# EAGLE design pcie2usbc (EAGLE 9.6.2)
AUTHOR: w. boyett; CONTACT_COMPANY: github.com/watsonboyett; LICENSE: CC-BY-SA; REV: 1A
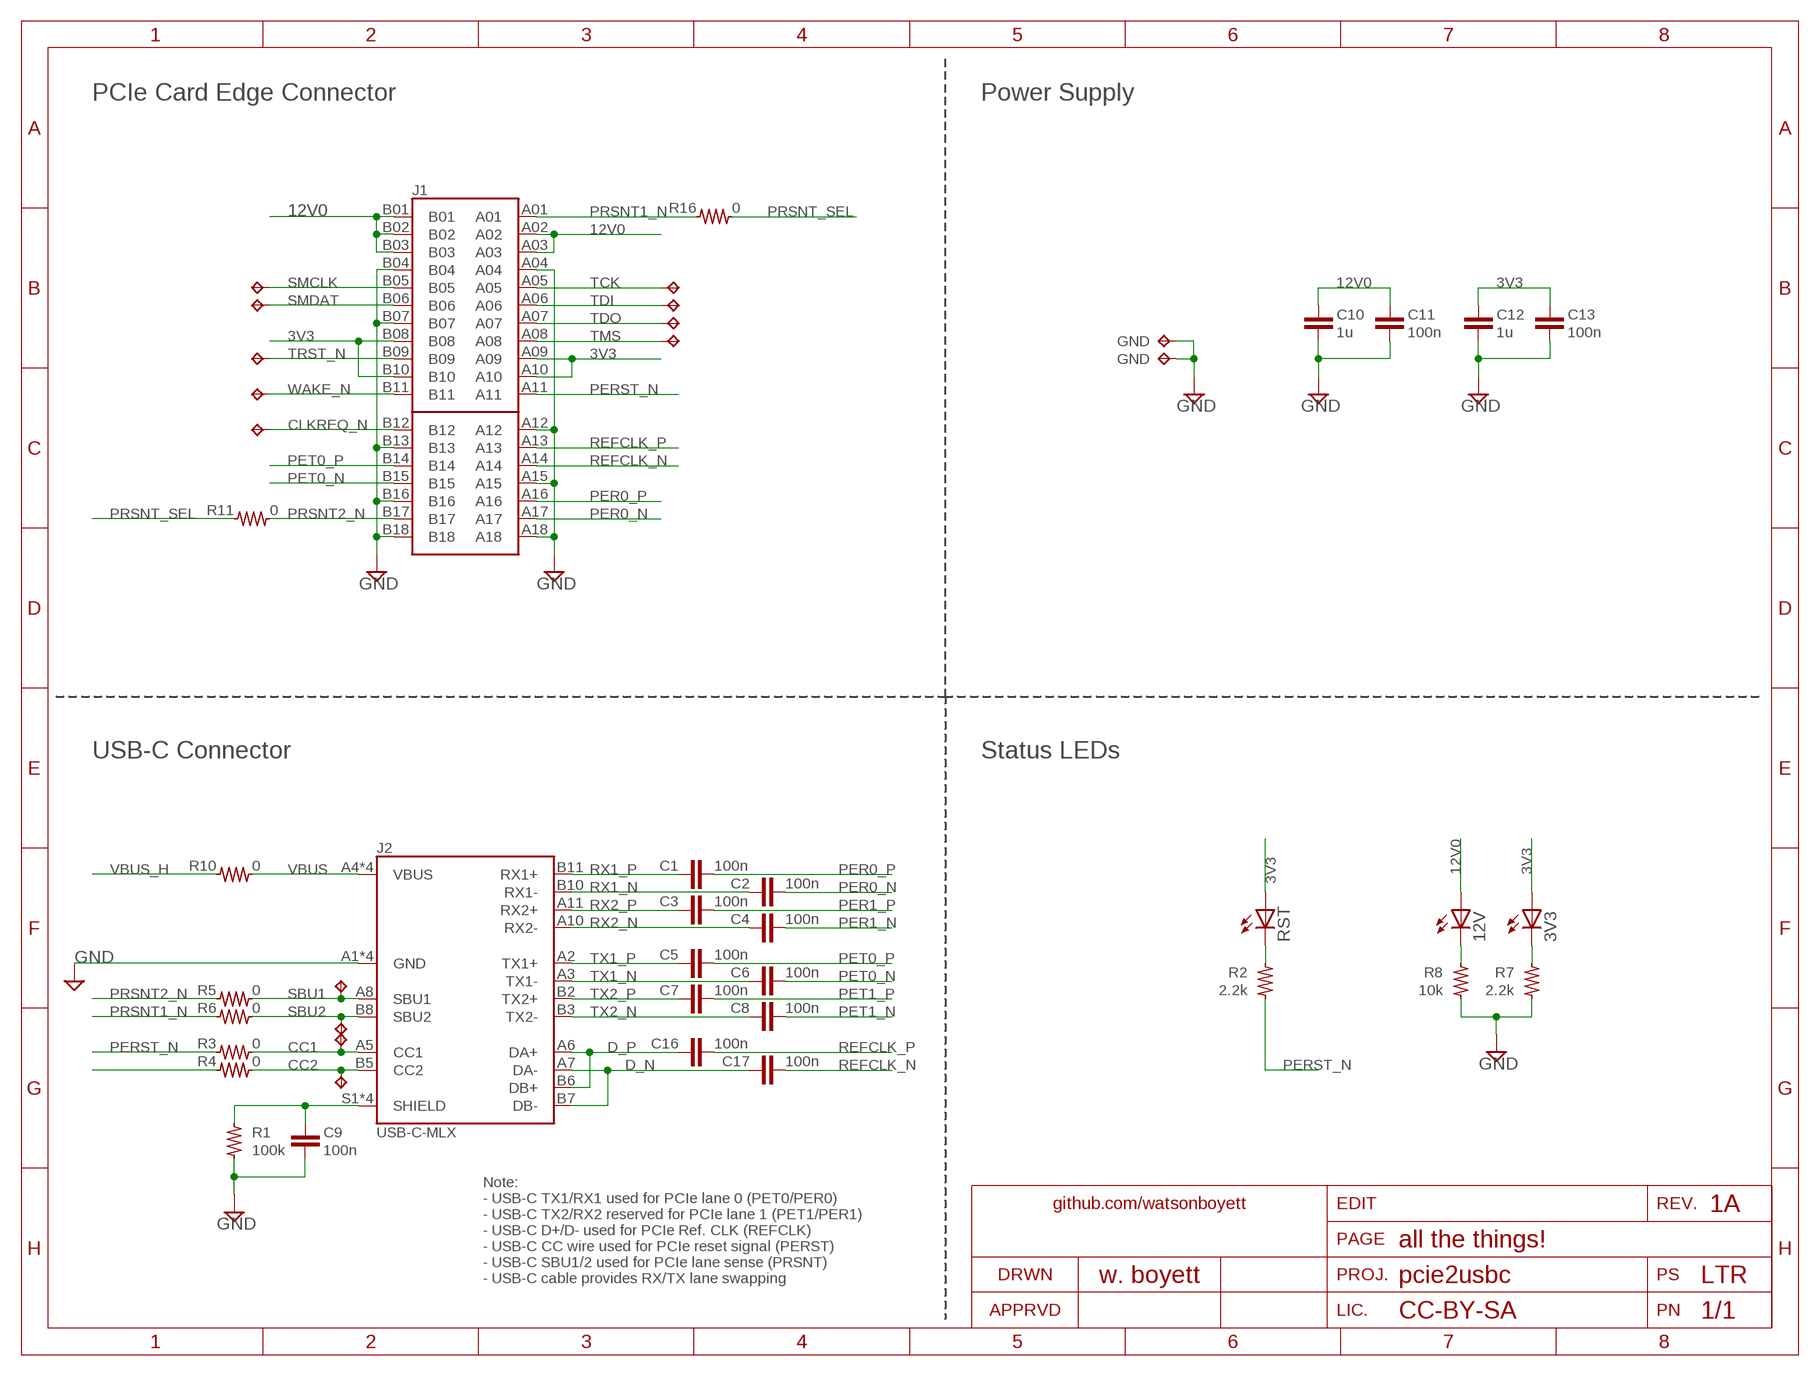
[diagram p0: schematic, sheet 1]
FRAME1 (FRAME_LTR_L): SECTION: all the things!

## Parts
3V3  LEDSML0805  [SML0805]
12V  LEDSML0805  [SML0805]
C1  100n  C-EUC0402  [C0402]
C2  100n  C-EUC0402  [C0402]
C3  100n  C-EUC0402  [C0402]
C4  100n  C-EUC0402  [C0402]
C5  100n  C-EUC0402  [C0402]
C6  100n  C-EUC0402  [C0402]
C7  100n  C-EUC0402  [C0402]
C8  100n  C-EUC0402  [C0402]
C9  100n  C-EUC0603K  [C0603K]
C10  1u  C-EUC0603K  [C0603K]
C11  100n  C-EUC0603K  [C0603K]
C12  1u  C-EUC0603K  [C0603K]
C13  100n  C-EUC0603K  [C0603K]
C16  100n  C-EUC0402  [C0402]
C17  100n  C-EUC0402  [C0402]
J1  PCIE-036-02-X-D-EMS2  [SAMTEC_PCIE-036-02-X-D-EMS2]
J2  USB-C-MLX  [MOLEX_105450-0101]
R1  100k  R-US_R0603  [R0603]
R2  2.2k  R-US_R0603  [R0603]
R3  0  R-US_R0603  [R0603]
R4  0  R-US_R0603  [R0603]
R5  0  R-US_R0603  [R0603]
R6  0  R-US_R0603  [R0603]
R7  2.2k  R-US_R0603  [R0603]
R8  10k  R-US_R0603  [R0603]
R10  0  R-US_R0603  [R0603]
R11  0  R-US_R0603  [R0603]
R16  0  R-US_R0603  [R0603]
RST  LEDSML0805  [SML0805]
TP1  TPB0,635  [B0,635]
TP2  TPB0,635  [B0,635]
TP3  TPB0,635  [B0,635]
TP4  TPB0,635  [B0,635]
TP5  TPB0,635  [B0,635]
TP6  TPB0,635  [B0,635]
TP7  TPB0,635  [B0,635]
TP8  TPB0,635  [B0,635]
TP9  TPB0,635  [B0,635]
TP10  TPTP38X20  [TP38X20]
TP11  TPB0,635  [B0,635]
TP12  TPB0,635  [B0,635]
TP13  TPTP38X20  [TP38X20]
TP16  TPB0,635  [B0,635]
TP21  TPB0,635  [B0,635]

## Nets
3V3: 3V3.A C12.1 C13.1 J1.A09 J1.A10 J1.B08 J1.B10 RST.A
12V0: 12V.A C10.1 C11.1 J1.A02 J1.A03 J1.B01 J1.B02 J1.B03
CC1: J2.A5(CC1) R3.2 TP21.TP
CC2: J2.B5(CC2) R4.1 TP16.TP
CLKREQ_N: J1.B12 TP9.TP
D_N [DIFF100]: C17.1 J2.A7(DA-) J2.B7(DB-)
D_P [DIFF100]: C16.1 J2.A6(DA+) J2.B6(DB+)
GND: C9.2 C10.2 C11.2 C12.2 C13.2 J1.A04 J1.A12 J1.A15 J1.A18 J1.B04 J1.B07 J1.B13 J1.B16 J1.B18 J2.A1(GND) J2.A12(GND) J2.B1(GND) J2.B12(GND) R1.1 R7.1 R8.1 TP10.TP TP13.TP
N$1: 12V.C R8.2
N$2: R4.2
N$3: 3V3.C R7.2
N$4: R2.2 RST.C
PER0_N [DIFF100]: C2.2 J1.A17
PER0_P [DIFF100]: C1.2 J1.A16
PER1_N: C4.2
PER1_P: C3.2
PERST_N: J1.A11 R2.1 R3.1
PET0_N [DIFF100]: C6.2 J1.B15
PET0_P [DIFF100]: C5.2 J1.B14
PET1_N: C8.2
PET1_P: C7.2
PRSNT1_N: J1.A01 R6.1 R16.1
PRSNT2_N: J1.B17 R5.1 R11.2
PRSNT_SEL: R11.1 R16.2
REFCLK_N [DIFF100]: C17.2 J1.A14
REFCLK_P [DIFF100]: C16.2 J1.A13
RX1_N [DIFF100]: C2.1 J2.B10(RX1-)
RX1_P [DIFF100]: C1.1 J2.B11(RX1+)
RX2_N [DIFF100]: C4.1 J2.A10(RX2-)
RX2_P [DIFF100]: C3.1 J2.A11(RX2+)
SBU1: J2.A8(SBU1) R5.2 TP11.TP
SBU2: J2.B8(SBU2) R6.2 TP12.TP
SMCLK: J1.B05 TP5.TP
SMDAT: J1.B06 TP6.TP
TCK: J1.A05 TP1.TP
TDI: J1.A06 TP2.TP
TDO: J1.A07 TP3.TP
TMS: J1.A08 TP4.TP
TRST_N: J1.B09 TP7.TP
TX1_N [DIFF100]: C6.1 J2.A3(TX1-)
TX1_P [DIFF100]: C5.1 J2.A2(TX1+)
TX2_N [DIFF100]: C8.1 J2.B3(TX2-)
TX2_P [DIFF100]: C7.1 J2.B2(TX2+)
USB_SHLD1: C9.1 J2.S1(SHIELD) J2.S2(SHIELD) J2.S3(SHIELD) J2.S4(SHIELD) R1.2
VBUS: J2.A4(VBUS) J2.A9(VBUS) J2.B4(VBUS) J2.B9(VBUS) R10.2
VBUS_H: R10.1
WAKE_N: J1.B11 TP8.TP

## Notes on the sheet
- PCIe Card Edge Connector | Power Supply
- USB-C Connector | Status LEDs
- Note: 
  - USB-C TX1/RX1 used for PCIe lane 0 (PET0/PER0)
  - USB-C TX2/RX2 reserved for PCIe lane 1 (PET1/PER1)
  - USB-C D+/D- used for PCIe Ref. CLK (REFCLK)
  - USB-C CC wire used for PCIe reset signal (PERST)
  - USB-C SBU1/2 used for PCIe lane sense (PRSNT)
  - USB-C cable provides RX/TX lane swapping

## Library data of the parts
3V3 12V RST = pcie2usbc:LED: LED OSRAM: - CHIPLED LG R971, LG N971, LY N971, LG Q971, LY Q971, LO R971, LY R971 LH N974, LH R974 LS Q976, LO Q976, LY Q976 LO Q996 - Hyper CHIPLED LW Q18S LB Q993, LB Q99A, LB R99A - SideLED LS A670, LO A670, LY A670, LG A670, LP A670 LB A673, LV A673, LT A673, LW A673 LH A674 LY A675 LS A676, LA A676, LO A676, LY A676, LW A676 LS A679, LY A679, LG A679 - Hyper Micro SIDELED® LS Y876, LA Y876, LO Y876, LY Y876 LT Y87S - SmartLED LW L88C, LW L88S LB L89C, LB L89S, LG L890 LS L89K, LO L89K, LY L89K LS L896, LA L896, LO L896, LY L896 - TOPLED LS T670, LO T670, LY T670, LG T670, LP T670 LSG T670, LSP T670, LSY T670, LOP T670, LYG T670 LG T671, LOG T671, LSG T671 LB T673, LV T673, LT T673, LW T673 LH T674 LS T676, LA T676, LO T676, LY T676, LB T676, LH T676, LSB T676, LW T676 LB T67C, LV T67C, LT T67C, LS T67K, LO T67K, LY T67K, LW E67C LS E67B, LA E67B, LO E67B, LY E67B, LB E67C, LV E67C, LT E67C LW T67C LS T679, LY T679, LG T679 LS T770, LO T770, LY T770, LG T770, LP T770 LB T773, LV T773, LT T773, LW T773 LH T774 LS E675, LA E675, LY E675, LS T675 LS T776, LA T776, LO T776, LY T776, LB T776 LHGB T686 LT T68C, LB T68C - Hyper Mini TOPLED® LB M676 - Mini TOPLED Santana® LG M470 LS M47K, LO M47K, LY M47K Source: http://www.osram.convergy.de LUXEON: - LUMILED® LXK2-PW12-R00, LXK2-PW12-S00, LXK2-PW14-U00, LXK2-PW14-V00 LXK2-PM12-R00, LXK2-PM12-S00, LXK2-PM14-U00 LXK2-PE12-Q00, LXK2-PE12-R00, LXK2-PE12-S00, LXK2-PE14-T00, LXK2-PE14-U00 LXK2-PB12-K00, LXK2-PB12-L00, LXK2-PB12-M00, LXK2-PB14-N00, LXK2-PB14-P00, LXK2-PB14-Q00 LXK2-PR12-L00, LXK2-PR12-M00, LXK2-PR14-Q00, LXK2-PR14-R00 LXK2-PD12-Q00, LXK2-PD12-R00, LXK2-PD12-S00 LXK2-PH12-R00, LXK2-PH12-S00 LXK2-PL12-P00, LXK2-PL12-Q00, LXK2-PL12-R00 Source: www.luxeon.com KINGBRIGHT: KA-3528ASYC Source: www.kingbright.com
C1-C8 C16 C17 = pcie2usbc:C-EU: CAPACITOR, European symbol
C9-C13 = pcie2usbc:C-EU: CAPACITOR, European symbol; DESCRIPTION: CAP CER 0.1UF 25V X7R 0603; MFG: Yageo; MPN: CC0603KRX7R8BB104; PN-DK: 311-1341-1-ND
J1 = pcie2usbc:PCIE-036-02-X-D-EMS2: PCI EXPRESS EDGE MOUNT ASSEMBLY,36PINS.; MANUFACTURER: Samtec; MAXIMUM_PACKAGE_HEIGHT: 3.715mm; PARTREV: C; STANDARD: Manufacturer Recommendations
J2 = pcie2usbc:USB-C: Usb Type-c, Ra Rcpt, Pcb Mount,; MFG: Molex; MPN: 1054500101; PN-DK: WM12856CT-ND
R1 = pcie2usbc:R-US_: RESISTOR, American symbol; DESCRIPTION: RES SMD 100K OHM 1% 1/10W 0603; MFG: Yageo; MPN: RC0603FR-07100KL; PN-DK: 311-100KHRCT-ND
R2-R8 R10 R11 R16 = pcie2usbc:R-US_: RESISTOR, American symbol
TP1-TP9 TP11 TP12 TP16 TP21 = pcie2usbc:TP: Test pad; DNP: DNP
TP10 TP13 = pcie2usbc:TP: Test pad; MFG: Keystone Electronics; MPN: 5019; PN-DK: 36-5019CT-ND; TP_SIGNAL_NAME: GND

## Net classes
0 default: width 0.152 mm
1 DIFF100: width 0.127 mm, clearance 0.305 mm
2 DIFF90: width 0.152 mm, clearance 0.305 mm

## Board
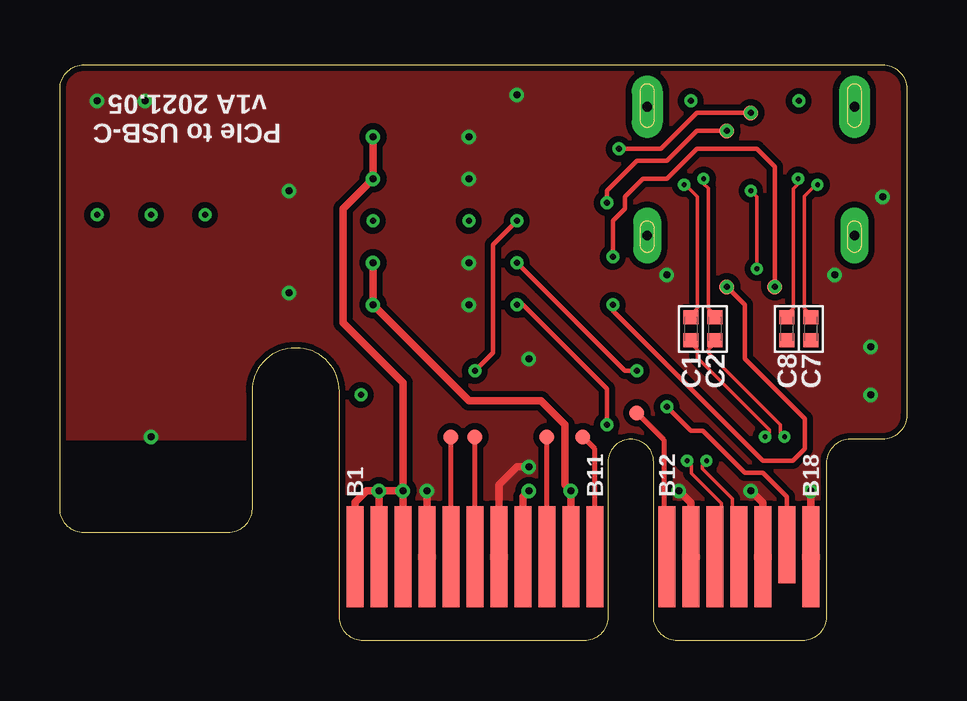
[diagram p1: board, top side]
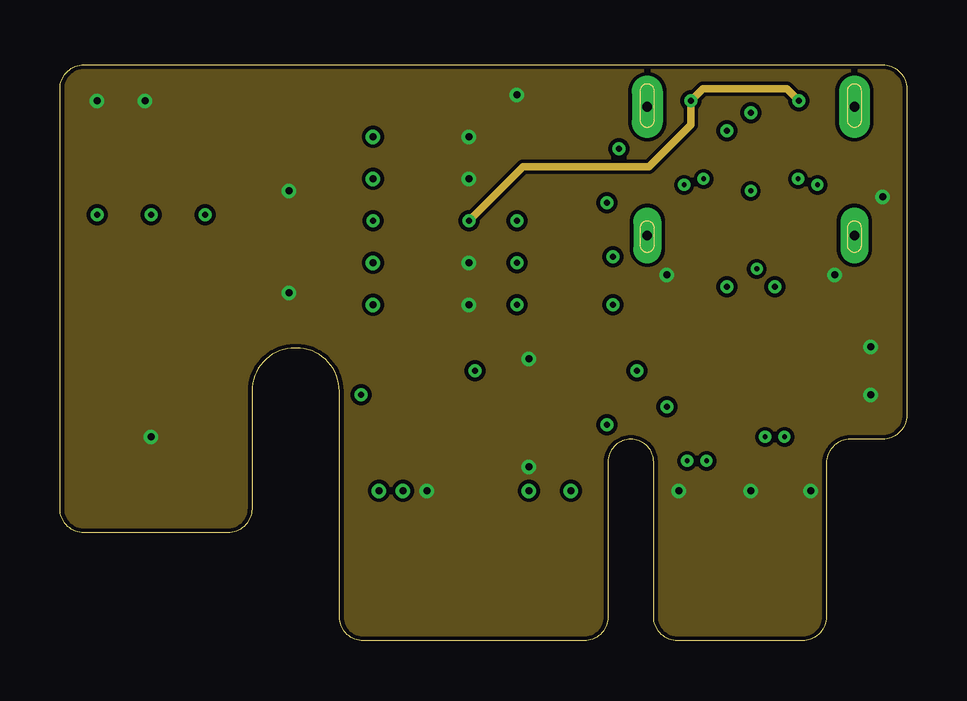
[diagram p2: board, inner layer GND1]
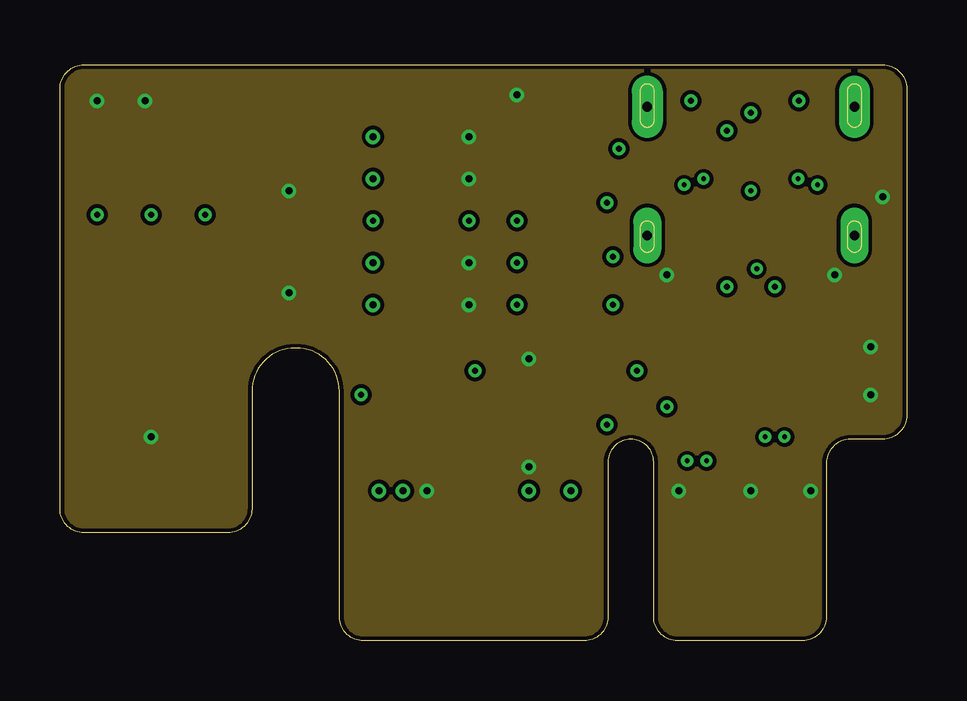
[diagram p3: board, inner layer GND2]
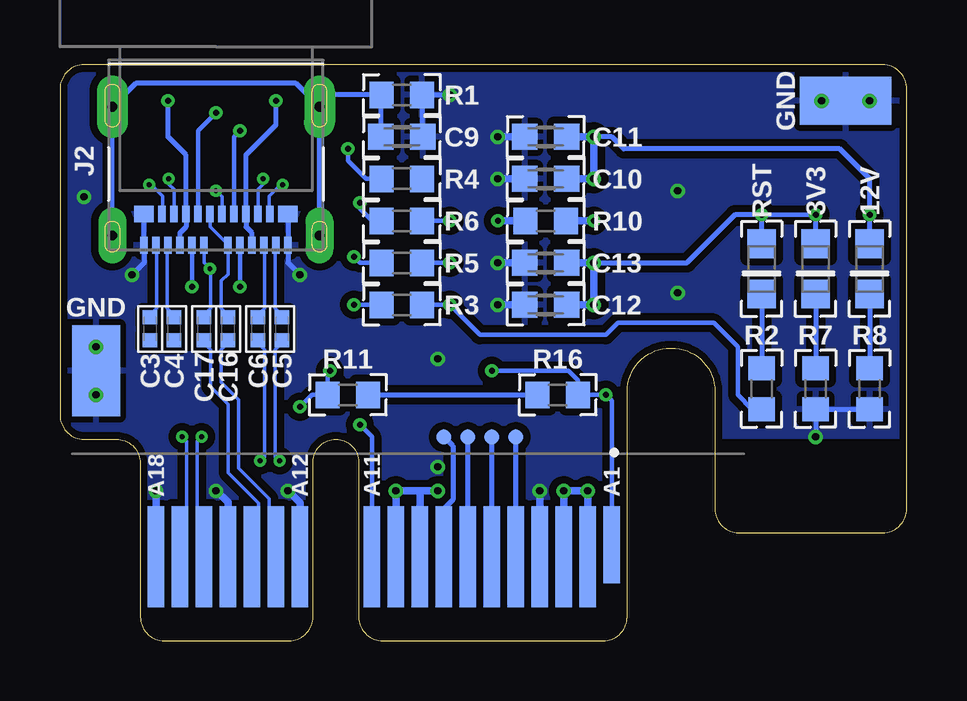
[diagram p4: board, bottom side, seen from below]

Size 35.3 x 24 mm. Coordinates in mm from the lower left corner, seen from the top.
Outline: 0,5.5 0,23 arc-90 1,24 34.3,24 arc-90 35.3,23 35.3,9.4 arc-90 34.3,8.4 32.95,8.4 arc90 31.95,7.4 31.95,1 arc-90 30.95,0 25.75,0 arc-90 24.75,1 24.75,7.45 arc90 23.8,8.4 arc90 22.85,7.45 22.85,1 arc-90 21.85,0 12.65,0 arc-90 11.65,1 11.65,10.4 arc90 9.85,12.2 9.8,12.2 arc90 8,10.4 8,5.5 arc-90 7,4.5 1,4.5 arc-90 0,5.5
Copper layers (1+2*15+16): Top 0.035mm / dielectric 0.11mm / GND1 0.035mm / dielectric 1.2mm / GND2 0.035mm / dielectric 0.11mm / Bottom 0.035mm
Design rules "default *": minimum track width 6mil, minimum drill 0.25mm, track to track 6mil, track to pad 6mil, pad to pad 6mil, via to via 6mil, smd to smd 6mil, copper to edge 7mil, drill to drill 6mil, minimum pad ring 15mil, minimum via ring 6mil, stop-mask expansion 2mil, vias tented up to drill 20mil, thermal gap 10mil
tRestrict: area -0.2,4.5 to 8.3,8
bRestrict: area -0.2,4.5 to 8.3,8

### Footprints (pad centres in the part's own frame; a part is rotated, then mirrored left to right if it is on the bottom)
SML0805 = smd 1.2 x 1.2: A 1.05,0; C -1.05,0
C0402 = smd 0.57 x 0.62: 1 -0.48,0; 2 0.48,0
C0603K = smd 1.05 x 1.08: 1 -0.875,0; 2 0.875,0
SAMTEC_PCIE-036-02-X-D-EMS2 = smd 0.7 x 3.2: A01 -11.5,-4 | smd 0.7 x 4.2: A02 -10.5,-3.5; A03 -9.5,-3.5; A04 -8.5,-3.5; A05 -7.5,-3.5; A06 -6.5,-3.5; A07 -5.5,-3.5; A08 -4.5,-3.5; A09 -3.5,-3.5; A10 -2.5,-3.5; A11 -1.5,-3.5; A12 1.5,-3.5; A13 2.5,-3.5; A14 3.5,-3.5; A15 4.5,-3.5; A16 5.5,-3.5; A17 6.5,-3.5; A18 7.5,-3.5 | smd 0.7 x 4.2 bottom: B01 -11.5,-3.5; B02 -10.5,-3.5; B03 -9.5,-3.5; B04 -8.5,-3.5; B05 -7.5,-3.5; B06 -6.5,-3.5; B07 -5.5,-3.5; B08 -4.5,-3.5; B09 -3.5,-3.5; B10 -2.5,-3.5; B11 -1.5,-3.5; B12 1.5,-3.5; B13 2.5,-3.5; B14 3.5,-3.5; B15 4.5,-3.5; B16 5.5,-3.5; B18 7.5,-3.5 | smd 0.7 x 3.2 bottom: B17 6.5,-4
MOLEX_105450-0101 = smd 0.3 x 0.7: A1 -3,3.77; A2 -2.5,3.77; A3 -2,3.77; A4 -1.5,3.77; A5 -1,3.77; A6 -0.5,3.77; A7 0.5,3.77; A8 1,3.77; A9 1.5,3.77; A10 2,3.77; A11 2.5,3.77; A12 3,3.77; B2 2.25,2.47; B3 1.75,2.47; B4 1.25,2.47; B5 0.75,2.47; B6 0.25,2.47; B7 -0.25,2.47; B8 -0.75,2.47; B9 -1.25,2.47; B10 -1.75,2.47; B11 -2.25,2.47 | smd 0.8 x 0.7: B1 3,2.47; B12 -3,2.47 | drill 0.406 pad 1.1 long: S1 -4.32,3.36; S2 4.32,3.36 | drill 0.406 pad 1.3 long: S3 -4.32,-2; S4 4.32,-2
R0603 = smd 1 x 1.1: 1 -0.85,0; 2 0.85,0
B0,635 = smd 0.635 x 0.635: TP 0,0
TP38X20 = smd 3.8 x 2: TP 0,0

### Placement (x,y rotation side)
3V3  3.8,15.5 90 bottom
12V  1.55,15.5 90 bottom
C1  26.3,13 270 top
C2  27.3,13 270 top
C3  31.55,13 270 bottom
C4  30.55,13 270 bottom
C5  26.05,13 270 bottom
C6  27.05,13 270 bottom
C7  31.3,13 270 top
C8  30.3,13 270 top
C9  21.05,21 0 bottom
C10  15.05,19.25 180 bottom
C11  15.05,21 180 bottom
C12  15.05,14 180 bottom
C13  15.05,15.75 180 bottom
C16  28.3,13 270 bottom
C17  29.3,13 270 bottom
J1  23.8,0 180 bottom
J2  28.8,20.25 180 bottom
R1  21.05,22.75 180 bottom
R2  6.05,10.5 90 bottom
R3  21.05,14 180 bottom
R4  21.05,19.25 0 bottom
R5  21.05,15.75 180 bottom
R6  21.05,17.5 180 bottom
R7  3.8,10.5 90 bottom
R8  1.55,10.5 90 bottom
R10  15.05,17.5 180 bottom
R11  23.3,10.25 180 bottom
R16  14.55,10.25 180 bottom
RST  6.05,15.5 90 bottom
TP1  16.3,8.5 270 bottom
TP2  17.3,8.5 270 bottom
TP3  18.3,8.5 270 bottom
TP4  19.3,8.5 270 bottom
TP5  16.3,8.5 90 top
TP6  17.3,8.5 90 top
TP7  20.3,8.5 90 top
TP8  21.8,8.5 90 top
TP9  24.05,9.5 90 top
TP10  2.55,22.5 180 bottom
TP11  29.8,14.75 90 top
TP12  27.8,21.25 90 top
TP13  33.8,11.25 90 bottom
TP16  28.8,22 0 top
TP21  27.8,14.75 0 top

### Tracks (layer width: path | path; a pad name or v marks a point on that pad's centre or on a via)
3V3  (via drill 0.25, 0.3)
  Top 0.305: v19.55,6.25 19.3,6 J1.B08 | J1.B10 v21.3,6.25 21.05,6.5 21.05,9 20.05,10 17.05,10 v13.05,14 v13.05,15.75
  Bottom 0.178: v6.05,17.75 v3.8,17.75
  Bottom 0.203: 3V3.A v3.8,17.75 | RST.A v6.05,17.75 7.18,17.75 9.18,15.75 v13.05,15.75
  Bottom 0.305: J1.B10 v21.3,6.25 20.3,6.25 | J1.A09 20.3,6.25 | 20.3,6.25 v19.55,6.25 | C13.1 v13.05,15.75 v13.05,14 C12.1
12V0  (via drill 0.25, 0.3)
  Top 0.305: J1.B03 v14.3,6.25 | J1.A02 v13.3,6.25 | J1.B01 12.3,5.77 12.78,6.25 v13.3,6.25 | v13.3,6.25 v14.3,6.25 | v14.3,6.25 14.3,10.75 11.8,13.25 11.8,18 v13.05,19.25 v13.05,21
  Bottom 0.203: 12V.A v1.55,17.75 1.55,19.25 2.8,20.5 11.8,20.5 12.3,21 v13.05,21
  Bottom 0.305: J1.A02 v13.3,6.25 v14.3,6.25 J1.B03 | C10.1 v13.05,19.25 v13.05,21 C11.1
CC1  (via drill 0.25)
  Top 0.178: TP21.TP 28.55,14 28.55,11.75 31.05,9.25 31.05,8 30.55,7.5 29.3,7.5 23.05,13.75 v23.05,14
  Bottom 0.178: J2.A5 TP21.TP | R3.2 v23.05,14
  other vias: 27.8,14.75
CC2  (via drill 0.25)
  Top 0.178: v23.3,20.5 25.05,20.5 26.55,22 TP16.TP
  Bottom 0.178: J2.B5 29.55,21.25 TP16.TP | v23.3,20.5 23.3,20 22.55,19.25 R4.1
  other vias: 28.8,22
CLKREQ_N
  Top 0.203: J1.B12 25.18,3.62 25.18,8.38 TP9.TP
D_N  (via drill 0.2)
  Top 0.152: v28.8,18.75 29.05,18.5 v29.05,15.5
  Bottom 0.152: v28.8,18.75 28.55,18.5 J2.B7 | J2.A7 29.3,15.75 v29.05,15.5 29.03,15.48 29.03,13.87 29.3,13.6 C17.1
D_P
  Bottom 0.152: J2.B6 29.05,17.25 28.3,16.5 J2.A6 28.3,15.27 28.57,15 28.57,13.87 28.3,13.6 C16.1
GND  (via drill 0.3)
  Top 0.305: J1.A04 v15.3,6.25 | J1.A18 v31.3,6.25 | v28.8,6.25 29.3,5.75 J1.B16 | J1.B13 26.3,5.75 v25.8,6.25 | J1.B07 18.3,6.5 19.05,7.25 v19.55,7.25
  Bottom 0.203: C9.2 20.2,21.02 R1.1 v19.05,22.75 | v33.8,10.25 TP13.TP v33.8,12.25 | v1.55,22.5 TP10.TP v3.55,22.5 | v32.3,15.25 31.8,15.75 J2.A12 J2.B1 | J2.B12 J2.A1 25.8,15.75 v25.3,15.25 | v3.8,8.5 R7.1 R8.1
  Bottom 0.254: v28.8,6.25 28.78,6.25
  Bottom 0.305: J1.A04 v15.3,6.25 | J1.A12 25.3,5.75 v25.8,6.25 | J1.A18 v31.3,6.25 | J1.A15 28.3,5.77 28.78,6.25 | v17.05,19.25 C10.2 | C11.2 v17.05,21 | C12.2 v17.05,14 | C13.2 v17.05,15.75
  other vias: 19.55,11.75 9.55,14.5 9.55,18.75 34.3,18.5
  pour GND1 (rank 3): -0.2,24.25 -0.2,-0.25 35.55,-0.25 35.55,24.25
  pour GND2 (rank 3): -0.2,24.25 -0.2,-0.25 35.55,-0.25 35.55,24.25
  pour Top (isolate 0.254, rank 3): -0.2,24.25 -0.2,-0.25 35.55,-0.25 35.55,24.25
  pour Bottom (isolate 0.305, rank 3): -0.2,24.25 -0.2,-0.25 35.55,-0.25 35.55,24.25
N$1
  Bottom 0.203: 12V.C R8.2
N$3
  Bottom 0.203: 3V3.C R7.2
N$4
  Bottom 0.203: RST.C R2.2
PER0_N  (via drill 0.2)
  Top 0.152: v30.21,8.5 30.03,8.68 30.03,9 27.03,12 27.03,12.13 27.3,12.4 C2.2
  Bottom 0.152: J1.A17 30.3,3.9 30.03,4.18 30.03,8.25 30.03,8.32 v30.21,8.5
PER0_P  (via drill 0.2)
  Top 0.152: v29.39,8.5 29.57,8.68 29.57,8.8 26.57,11.8 26.57,12.13 26.3,12.4 C1.2
  Bottom 0.152: J1.A16 29.3,3.9 29.57,4.18 29.57,8.25 29.57,8.32 v29.39,8.5
PERST_N  (via drill 0.25)
  Top 0.178: v22.8,9 22.8,10.5 19.3,14 v19.05,14
  Bottom 0.178: v22.8,9 22.3,8.5 J1.A11 | R3.1 v19.05,14 17.8,12.75 12.55,12.75 12.05,13.25 8.05,13.25 7.05,12.25 7.05,10.25 6.45,9.65 R2.1
PET0_N  (via drill 0.2)
  Top 0.152: J1.B15 28.3,3.9 28.03,4.18 28.03,5.92 26.78,7.17 26.78,7.32 v26.96,7.5
  Bottom 0.152: v26.96,7.5 26.78,7.68 26.78,12.13 27.05,12.4 C6.2
PET0_P  (via drill 0.2)
  Top 0.152: J1.B14 27.3,3.9 27.57,4.18 27.57,5.73 26.32,6.98 26.32,7.32 v26.14,7.5
  Bottom 0.152: v26.14,7.5 26.32,7.68 26.32,12.13 26.05,12.4 C5.2
PRSNT1_N  (via drill 0.25)
  Top 0.178: v19.05,17.5 18.3,16.75 18.05,16.5 18.05,12 v17.3,11.25
  Bottom 0.178: J1.A01 12.3,10 v12.55,10.25 R16.1 13.7,10.85 14.1,11.25 v17.3,11.25 | R6.1 v19.05,17.5
PRSNT2_N  (via drill 0.25)
  Top 0.178: v25.3,9.75 26.3,8.75 26.8,8.75 28.55,7 29.3,7 30.3,6 J1.B17 | v19.05,15.75 20.05,14.75 23.55,11.25 v24.05,11.25
  Bottom 0.178: R5.1 v19.05,15.75 | v24.05,11.25 24.15,11.15 R11.2 24.8,10.25 v25.3,9.75
PRSNT_SEL
  Bottom 0.203: R11.1 R16.2
REFCLK_N
  Bottom 0.152: J1.A14 27.3,4.91 27.03,5.18 27.03,5.73 28.3,7 28.3,9.85 29.03,10.58 29.03,12.13 29.3,12.4 C17.2
REFCLK_P
  Bottom 0.152: J1.A13 26.3,4.91 26.57,5.18 26.57,5.92 27.84,7.19 27.84,10.04 28.57,10.77 28.57,12.13 28.3,12.4 C16.2
RX1_N  (via drill 0.2)
  Top 0.152: v26.83,19.25 26.83,19.05 27.03,18.85 27.03,13.87 27.3,13.6 C2.1
  Bottom 0.152: J2.B10 27.05,18.8 26.83,19.02 v26.83,19.25
RX1_P  (via drill 0.2)
  Top 0.152: v26.02,19 26.07,19 26.57,18.5 26.57,13.87 26.3,13.6 C1.1
  Bottom 0.152: v26.02,19 26.09,19 26.57,18.52 26.57,17.8 J2.B11
RX2_N
  Bottom 0.152: J2.A10 30.8,16.32 30.82,16.3 30.82,13.87 30.55,13.6 C4.1
RX2_P
  Bottom 0.152: J2.A11 31.3,16.32 31.28,16.3 31.28,13.87 31.55,13.6 C3.1
SBU1  (via drill 0.25)
  Top 0.178: v23.05,16 23.05,17.5 23.55,18 23.55,18.5 24.3,19.25 25.3,19.25 26.55,20.5 29.05,20.5 29.8,19.75 TP11.TP
  Bottom 0.178: R5.2 22.8,15.75 v23.05,16 | J2.A8 TP11.TP
  other vias: 29.8,14.75
SBU2  (via drill 0.25)
  Top 0.178: v22.8,18.25 22.8,18.75 24.05,20 25.3,20 26.55,21.25 TP12.TP
  Bottom 0.178: J2.B8 28.05,21 TP12.TP | R6.2 22.3,17.5 22.8,18 v22.8,18.25
  other vias: 27.8,21.25
SMCLK
  Top 0.203: J1.B05 TP5.TP
SMDAT
  Top 0.203: J1.B06 TP6.TP
TCK
  Bottom 0.203: J1.A05 TP1.TP
TDI
  Bottom 0.203: J1.A06 TP2.TP
TDO
  Bottom 0.203: J1.A07 TP3.TP
TMS
  Bottom 0.203: J1.A08 19.3,5.5 18.93,5.88 18.93,8.12 TP4.TP
TRST_N
  Top 0.203: J1.B09 TP7.TP
TX1_N
  Bottom 0.152: J2.A3 26.8,16.32 26.78,16.3 26.78,13.87 27.05,13.6 C6.1
TX1_P
  Bottom 0.152: J2.A2 26.3,16.32 26.32,16.3 26.32,13.87 26.05,13.6 C5.1
TX2_N  (via drill 0.2)
  Top 0.152: v30.77,19.25 30.77,19.02 30.57,18.83 30.57,13.87 30.3,13.6 C8.1
  Bottom 0.152: J2.B3 30.55,18.8 30.77,19.02 v30.77,19.25
TX2_P  (via drill 0.2)
  Top 0.152: v31.58,19 31.51,19 31.03,18.52 31.03,13.87 31.3,13.6 C7.1
  Bottom 0.152: v31.58,19 31.51,19 31.03,18.52 31.03,17.8 J2.B2
USB_SHLD1
  Bottom 0.203: C9.1 21.93,22.73 R1.2 23.98,22.75 J2.S3 | J2.S1 J2.S3 | J2.S2 J2.S4 32.12,23.25 25.48,23.25 J2.S3
VBUS  (via drill 0.25)
  GND1 0.305: v17.05,17.5 19.3,19.75 24.55,19.75 26.3,21.5 v26.3,22.5 26.8,23 30.3,23 v30.8,22.5
  Bottom 0.203: v26.3,22.5 26.3,21.5 27.55,20.25 J2.B9 27.55,17.25 27.3,17 J2.A4 | v30.8,22.5 30.8,21 30.05,20.25 J2.B4 30.05,17.25 30.3,17 J2.A9
  Bottom 0.305: R10.2 v17.05,17.5
VBUS_H  (via drill 0.25)
  Bottom 0.305: R10.1 v13.05,17.5
WAKE_N
  Top 0.203: J1.B11 22.3,8 TP8.TP

### Text on the board
tPlace: PCIe to USB-C / v1A 2021.05